# EAGLE design maze 1 (EAGLE 9.6.2)
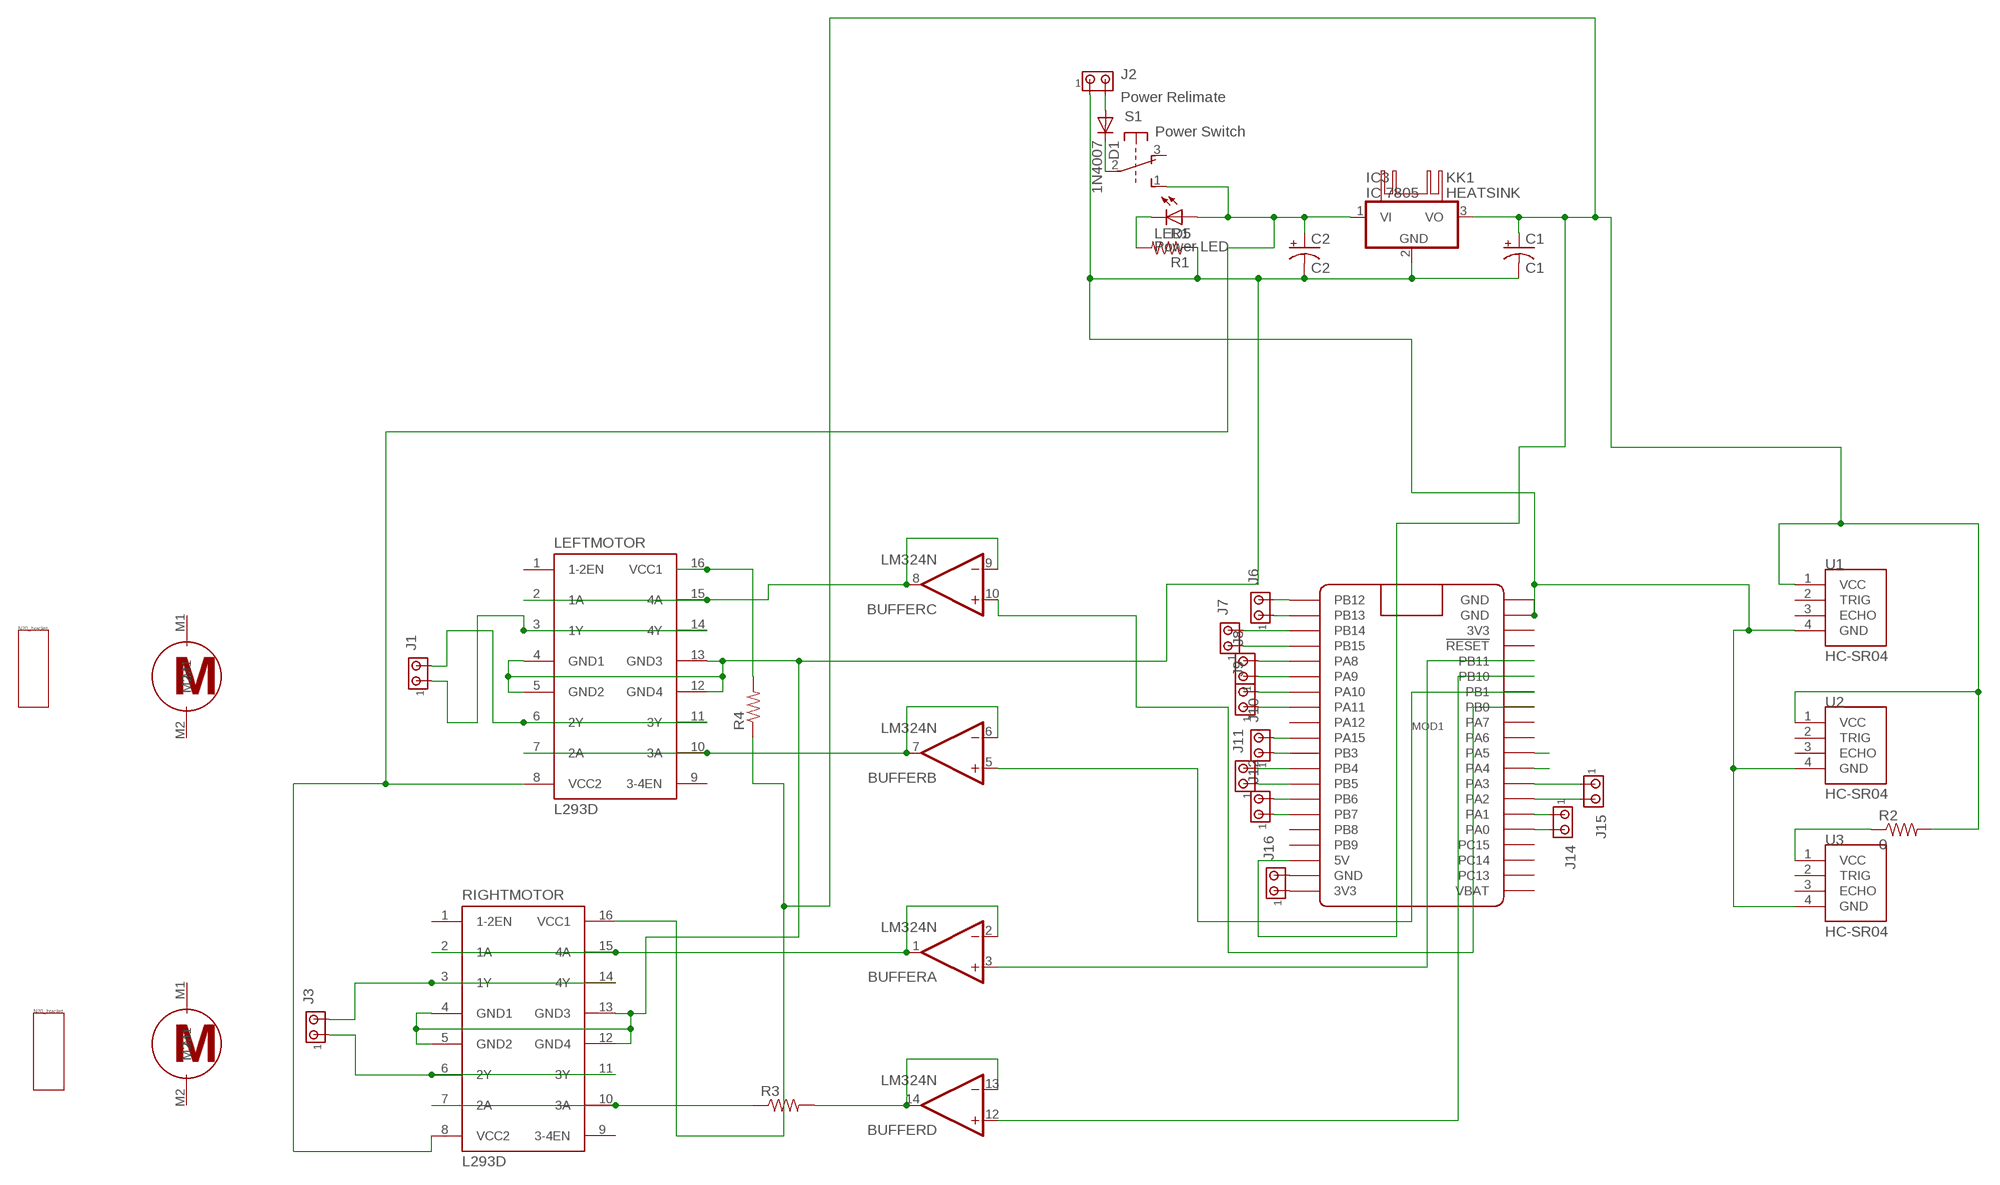
[diagram p0: schematic, sheet 1]

## Parts
BUFFER  LM324N  [DIL14]
C1  C1  1000UF-RADIAL-5MM-25V-20%  [CPOL-RADIAL-5MM-10MM]
C2  C2  CPOL-USE3.5-8  [E3,5-8]
D1  1N4007  1N4004  [DO41-10]
IC3  IC 7805  7805TV  [TO220V]
J1  MTA02-100  [10X02MTA]
J2  Power Relimate  MTA02-100  [10X02MTA]
J3  MTA02-100  [10X02MTA]
J6  MTA02-100  [10X02MTA]
J7  MTA02-100  [10X02MTA]
J8  MTA02-100  [10X02MTA]
J9  MTA02-100  [10X02MTA]
J10  MTA02-100  [10X02MTA]
J11  MTA02-100  [10X02MTA]
J12  MTA02-100  [10X02MTA]
J14  MTA02-100  [10X02MTA]
J15  MTA02-100  [10X02MTA]
J16  MTA02-100  [10X02MTA]
KK1  HEATSINK  [HEATSINK]
LED5  Power LED  LED3MM  [LED3MM]
LEFTMOTOR  L293D  [DIL16]
MOD1  BLUE_PILL  [BLUE_PILL]
R1  R1  R-US_0204/7  [0204/7]
R2  0  R-US_0204/7  [0204/7]
R3  R-US_0204/7  [0204/7]
R4  R-US_0204/7  [0204/7]
RIGHTMOTOR  L293D  [DIL16]
S1  Power Switch  9077-2  [9077-2]
U1  HC-SR04  [XCVR_HC-SR04]
U2  HC-SR04  [XCVR_HC-SR04]
U3  HC-SR04  [XCVR_HC-SR04]
U$1  MOTOR_N20  [MOTOR_N20]
U$2  MOTOR_N20  [MOTOR_N20]
U$4  N20_BRACKET  [BRACKER]
U$5  N20_BRACKET  [BRACKER]

## Nets
5V: C1.+ IC3.3(VO) MOD1.P$18(5V) R2.2 R4.1 RIGHTMOTOR.16(VCC1) U1.1(VCC) U2.1(VCC)
12V: C2.+ IC3.1(VI) LED5.A LEFTMOTOR.8(VCC2) RIGHTMOTOR.8(VCC2) S1.1(1:S)
GND: C1.- C2.- IC3.2(GND) J2.1 LEFTMOTOR.4(GND1) LEFTMOTOR.5(GND2) LEFTMOTOR.12(GND4) LEFTMOTOR.13(GND3) MOD1.P$21(GND) MOD1.P$22(GND) R1.1 RIGHTMOTOR.4(GND1) RIGHTMOTOR.5(GND2) RIGHTMOTOR.12(GND4) RIGHTMOTOR.13(GND3) U1.4(GND) U2.4(GND) U3.4(GND)
N$1: BUFFER.12(D:+IN) MOD1.P$26(PB10)
N$2: D1.A J2.2
N$3: BUFFER.5(B:+IN) MOD1.P$27(PB1)
N$4: R2.1 U3.1(VCC)
N$5: J1.2 LEFTMOTOR.6(2Y) LEFTMOTOR.11(3Y)
N$6: LED5.K(C) R1.2
N$7: BUFFER.8(C:OUT) BUFFER.9(C:-IN) LEFTMOTOR.2(1A) LEFTMOTOR.15(4A)
N$9: BUFFER.13(D:-IN) BUFFER.14(D:OUT) R3.2
N$10: BUFFER.10(C:+IN) MOD1.P$28(PB0)
N$11: D1.C S1.2(1:P)
N$13: LEFTMOTOR.16(VCC1) R4.2
N$15: BUFFER.6(B:-IN) BUFFER.7(B:OUT) LEFTMOTOR.7(2A) LEFTMOTOR.10(3A)
N$18: J1.1 LEFTMOTOR.3(1Y) LEFTMOTOR.14(4Y)
N$20: MOD1.P$31(PA5)
N$22: MOD1.P$32(PA4)
N$24: BUFFER.3(A:+IN) MOD1.P$25(PB11)
N$25: R3.1 RIGHTMOTOR.7(2A) RIGHTMOTOR.10(3A)
N$26: J15.1 MOD1.P$33(PA3)
N$27: J15.2 MOD1.P$34(PA2)
N$28: J14.1 MOD1.P$35(PA1)
N$29: J14.2 MOD1.P$36(PA0)
N$30: J6.1 MOD1.P$2(PB13)
N$31: J6.2 MOD1.P$1(PB12)
N$32: J3.2 RIGHTMOTOR.3(1Y) RIGHTMOTOR.14(4Y)
N$33: J7.2 MOD1.P$3(PB14)
N$34: BUFFER.1(A:OUT) BUFFER.2(A:-IN) RIGHTMOTOR.2(1A) RIGHTMOTOR.15(4A)
N$35: J3.1 RIGHTMOTOR.6(2Y) RIGHTMOTOR.11(3Y)
N$36: J7.1 MOD1.P$4(PB15)
N$37: J8.2 MOD1.P$5(PA8)
N$38: J8.1 MOD1.P$6(PA9)
N$39: J10.2 MOD1.P$10(PA15)
N$40: J10.1 MOD1.P$11(PB3)
N$41: J11.2 MOD1.P$12(PB4)
N$42: J11.1 MOD1.P$13(PB5)
N$43: J12.2 MOD1.P$14(PB6)
N$44: J12.1 MOD1.P$15(PB7)
N$47: J9.2 MOD1.P$7(PA10)
N$48: J9.1 MOD1.P$8(PA11)
N$49: J16.1 MOD1.P$20(3V3)
N$50: J16.2 MOD1.P$19(GND)
Unconnected: LEFTMOTOR.1(1-2EN) LEFTMOTOR.9(3-4EN) MOD1.P$9(PA12) MOD1.P$16(PB8) MOD1.P$17(PB9) MOD1.P$23(3V3) MOD1.P$24(!RESET) MOD1.P$29(PA7) MOD1.P$30(PA6) MOD1.P$37(PC15) MOD1.P$38(PC14) MOD1.P$39(PC13) MOD1.P$40(VBAT) RIGHTMOTOR.1(1-2EN) RIGHTMOTOR.9(3-4EN) S1.3(1:O) S1.4(2:S) S1.5(2:P) S1.6(2:O) U1.2(TRIG) U1.3(ECHO) U2.2(TRIG) U2.3(ECHO) U3.2(TRIG) U3.3(ECHO) U$1.M1 U$1.M2 U$2.M1 U$2.M2

## Power pins joined to a net without a drawn wire
5V: BUFFER.4(P:V+)
GND: BUFFER.11(P:V-)

## Library data of the parts
BUFFER = linear:LM324: OP AMP
C1 = SparkFun-Capacitors:1000UF: 1,000µF/1mF ceramic capacitors A capacitor is a passive two-terminal electrical component used to store electrical energy temporarily in an electric field. CAP-08070; PROD_ID: CAP-09538; VALUE: 1mF
C2 = adafruit:CPOL-US: POLARIZED CAPACITOR, American symbol
D1 = adafruit:1N4004: DIODE General purpose 1N400x type rectifier (With bigger pads) http://www.ladyada.net/library/pcb/eaglelibrary.html
IC3 = linear:78*: Positive VOLTAGE REGULATOR Source: http://cache.national.com/ds/LM/LM78L05.pdf http://www.fairchildsemi.com/ds/LM/LM7805.pdf
J1-J3 J6-J12 J14-J16 = con-amp:MTA02-100: AMP connector
KK1 = heatsink:HEATSINK: Made by Aniruddha Damle (TRSKNCOE)
LED5 = adafruit:LED: LED OSRAM: - CHIPLED LG R971, LG N971, LY N971, LG Q971, LY Q971, LO R971, LY R971 LH N974, LH R974 LS Q976, LO Q976, LY Q976 LO Q996 - Hyper CHIPLED LW Q18S LB Q993, LB Q99A, LB R99A - SideLED LS A670, LO A670, LY A670, LG A670, LP A670 LB A673, LV A673, LT A673, LW A673 LH A674 LY A675 LS A676, LA A676, LO A676, LY A676, LW A676 LS A679, LY A679, LG A679 - Hyper Micro SIDELED® LS Y876, LA Y876, LO Y876, LY Y876 LT Y87S - SmartLED LW L88C, LW L88S LB L89C, LB L89S, LG L890 LS L89K, LO L89K, LY L89K LS L896, LA L896, LO L896, LY L896 - TOPLED LS T670, LO T670, LY T670, LG T670, LP T670 LSG T670, LSP T670, LSY T670, LOP T670, LYG T670 LG T671, LOG T671, LSG T671 LB T673, LV T673, LT T673, LW T673 LH T674 LS T676, LA T676, LO T676, LY T676, LB T676, LH T676, LSB T676, LW T676 LB T67C, LV T67C, LT T67C, LS T67K, LO T67K, LY T67K, LW E67C LS E67B, LA E67B, LO E67B, LY E67B, LB E67C, LV E67C, LT E67C LW T67C LS T679, LY T679, LG T679 LS T770, LO T770, LY T770, LG T770, LP T770 LB T773, LV T773, LT T773, LW T773 LH T774 LS E675, LA E675, LY E675, LS T675 LS T776, LA T776, LO T776, LY T776, LB T776 LHGB T686 LT T68C, LB T68C - Hyper Mini TOPLED® LB M676 - Mini TOPLED Santana® LG M470 LS M47K, LO M47K, LY M47K Source: http://www.osram.convergy.de/
LEFTMOTOR RIGHTMOTOR = st-microelectronics:L293D: PUSH-PULL 4 CHANNEL DRIVER; MPN: L293D; OC_FARNELL: 9589619; OC_NEWARK: 56P8249
MOD1 = BluePill:BLUE_PILL
R1-R4 = adafruit:R-US_: RESISTOR, American symbol
S1 = switch-misc:9077-2: MARQUARDT SWITCH 9077.0200 Distributor: Buerklin <https://www.buerklin.com/default.asp?event=ShowArtikel%2812G2822%29&l=d&jump=ArtNr_12G2822>
U1-U3 = HC-SR04:HC-SR04: Ultrasonic Sensor Module Check availability <https://pricing.snapeda.com/parts/HC-SR04/OSEPP%20Electronics/view-part?ref=eda>; AVAILABILITY: In Stock; CHECK_PRICES: https://www.snapeda.com/parts/HC-SR04/Applied+Avionics/view-part/?ref=eda; DESCRIPTION: Ultrasonic Sensor Module,Rectangular,20-4000 mm,5 V,15 mA,Arduino Compatible | OSEPP HC-SR04; MF: OSEPP Electronics; MP: HC-SR04; PACKAGE: None; PRICE: None; SNAPEDA_LINK: https://www.snapeda.com/parts/HC-SR04/Applied+Avionics/view-part/?ref=snap
U$1 U$2 = Motor N20:MOTOR_N20
U$4 U$5 = Motor N20:N20_BRACKET

## Board
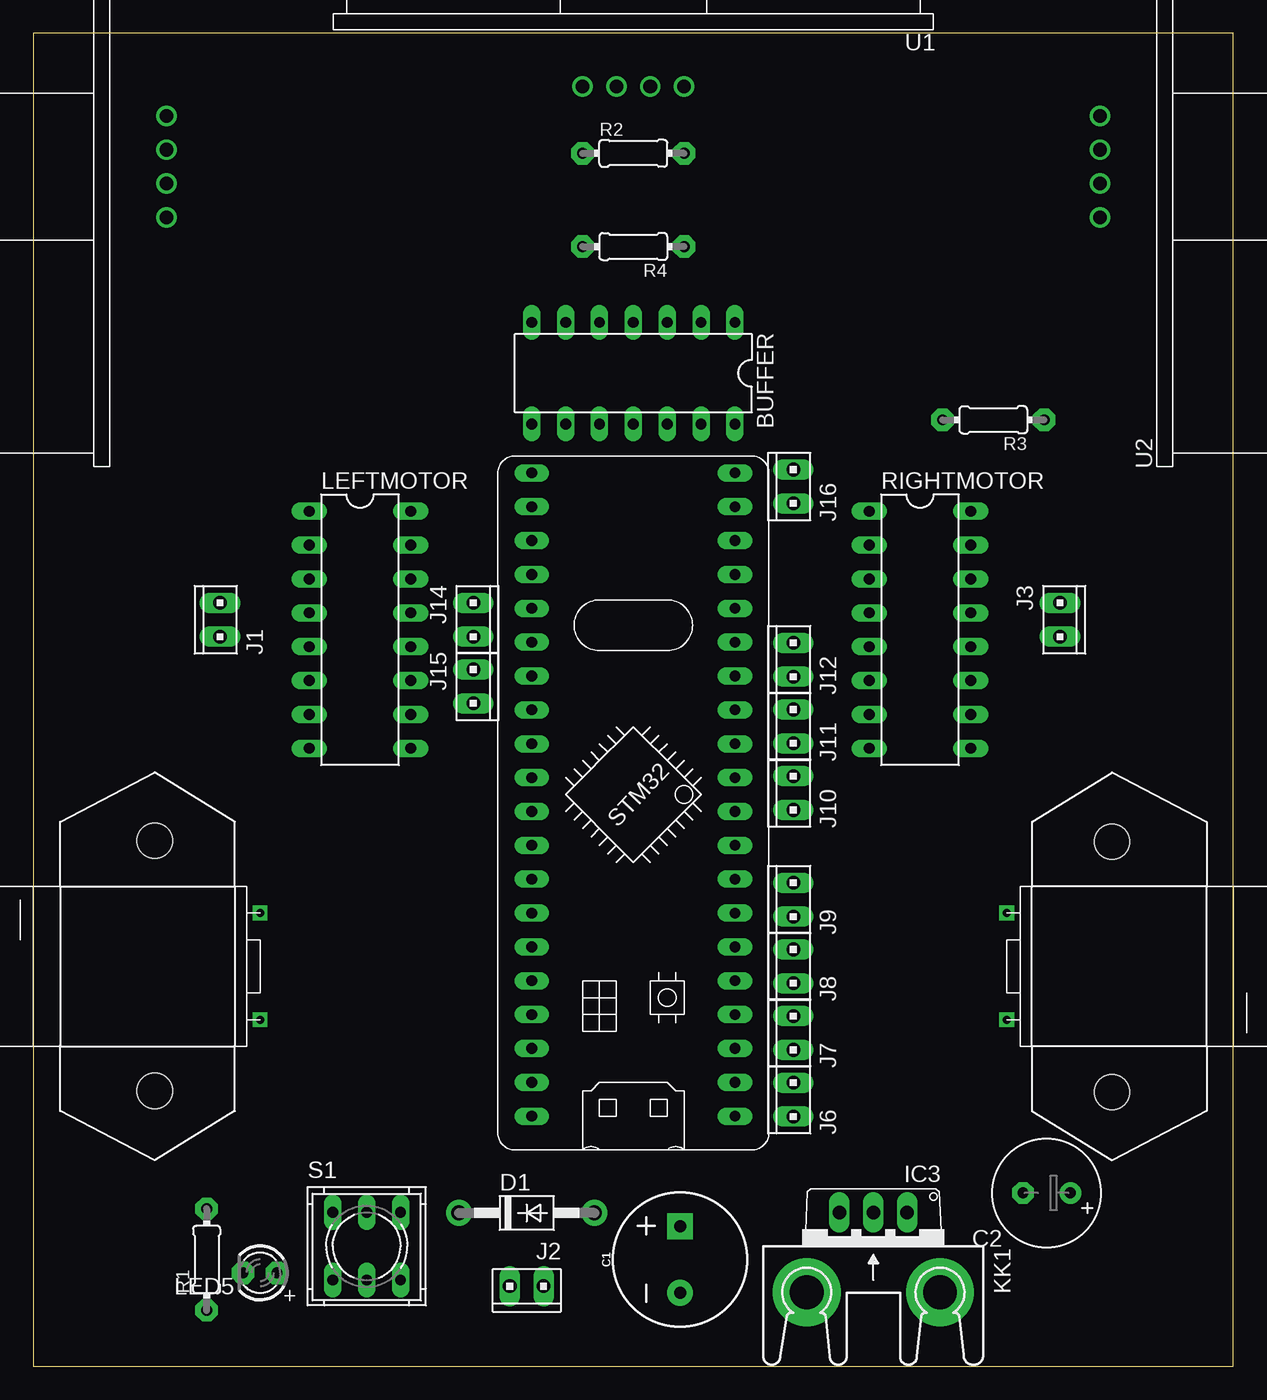
[diagram p1: board, top side]
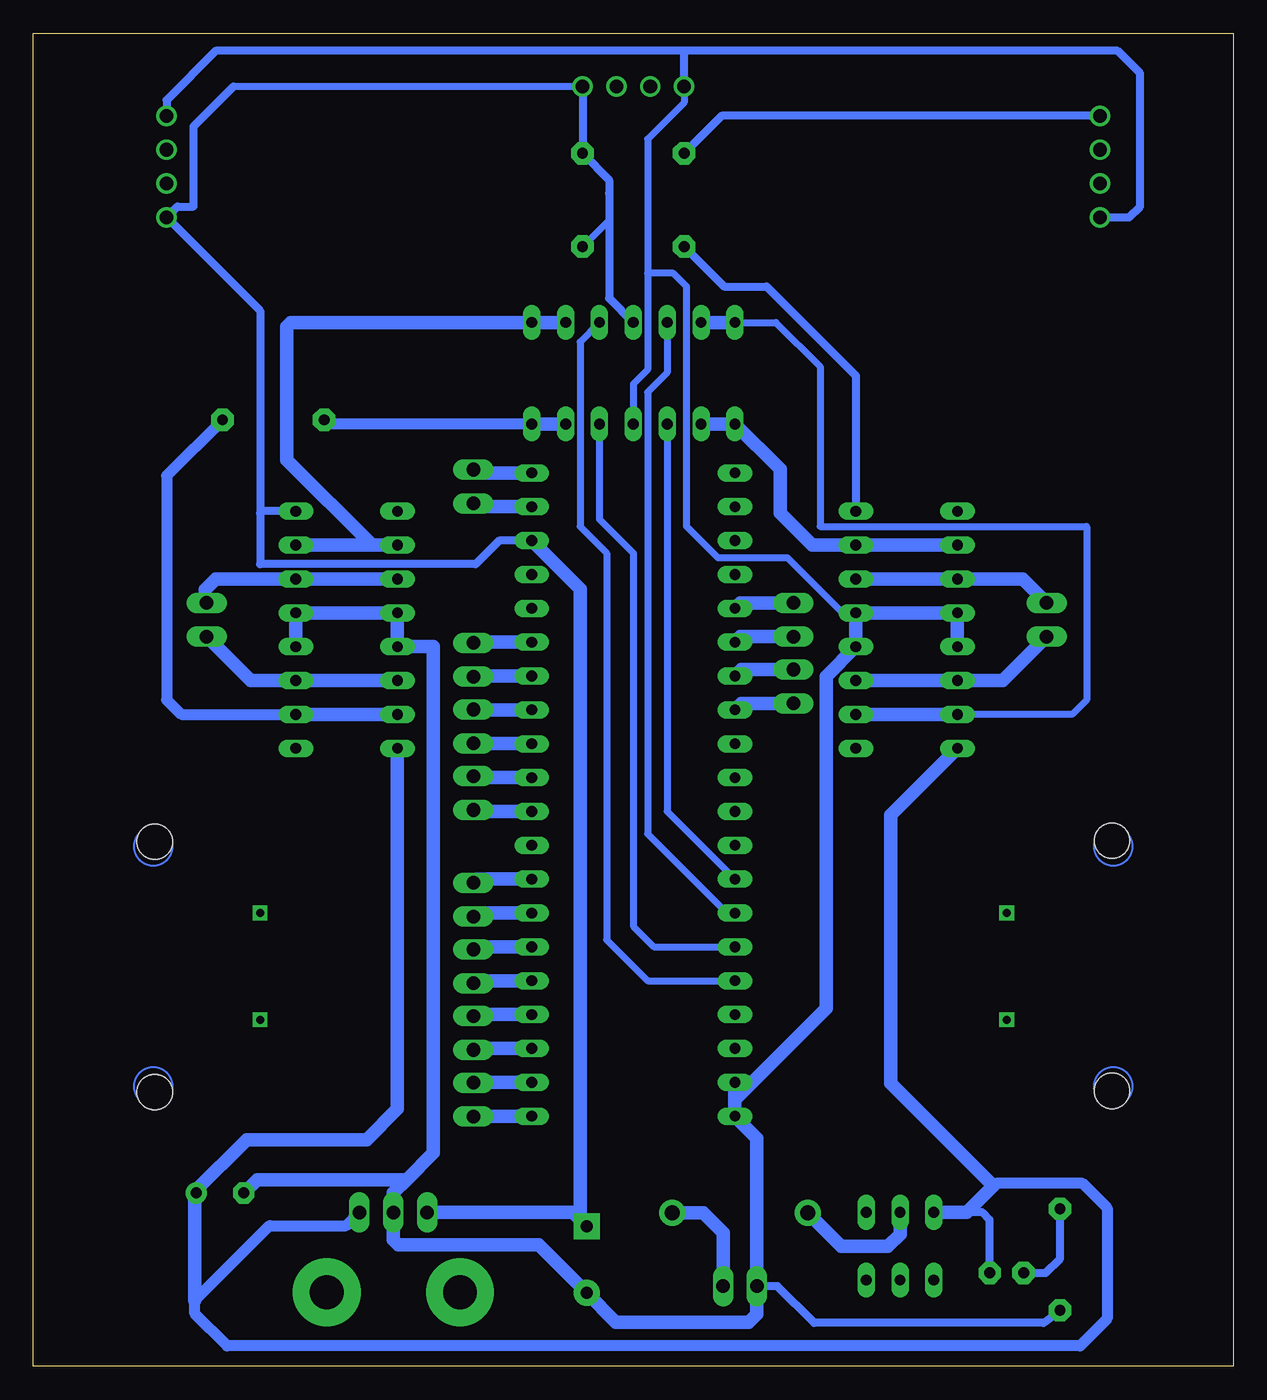
[diagram p2: board, bottom side, seen from below]

Size 90 x 100 mm. Coordinates in mm from the lower left corner, seen from the top.
Outline: 0,0 90,0 90,100 0,100 0,0
Copper layers (1*16): Top 0.035mm / dielectric 1.5mm / Bottom 0.035mm
Design rules "default *": minimum track width 10mil, minimum drill 24mil, track to track 8mil, track to pad 6mil, pad to pad 8mil, via to via 8mil, smd to smd 8mil, copper to edge 40mil, drill to drill 8mil, minimum pad ring 10mil, minimum via ring 8mil, stop-mask expansion 4mil, vias tented up to drill 0mil, thermal gap 10mil

### Footprints (pad centres in the part's own frame; a part is rotated, then mirrored left to right if it is on the bottom)
DIL14 = drill 0.813 long: 1 -7.62,-3.81; 2 -5.08,-3.81; 3 -2.54,-3.81; 4 0,-3.81; 5 2.54,-3.81; 6 5.08,-3.81; 7 7.62,-3.81; 8 7.62,3.81; 9 5.08,3.81; 10 2.54,3.81; 11 0,3.81; 12 -2.54,3.81; 13 -5.08,3.81; 14 -7.62,3.81
CPOL-RADIAL-5MM-10MM = drill 0.9 pad 1.93 square: + 2.5,0 | drill 0.9 pad 1.93: - -2.5,0
E3,5-8 = drill 0.813 pad 1.6: + -1.778,0 | drill 0.813 pad 1.6 octagon: - 1.778,0
DO41-10 = drill 1.118 pad 1.93: A 5.08,0; C -5.08,0
TO220V = drill 1.016 long: 1 -2.54,-2.54; 2 0,-2.54; 3 2.54,-2.54
10X02MTA = drill 1.016 long: 1 1.27,0; 2 -1.27,0
HEATSINK = drill 2.54 pad 5.08: A2,5 -5,3.45; B2,5 5,3.45
LED3MM = drill 0.813 pad 1.676 octagon: A -1.27,0; K 1.27,0
DIL16 = drill 0.813 long: 1 -8.89,-3.81; 2 -6.35,-3.81; 3 -3.81,-3.81; 4 -1.27,-3.81; 5 1.27,-3.81; 6 3.81,-3.81; 7 6.35,-3.81; 8 8.89,-3.81; 9 8.89,3.81; 10 6.35,3.81; 11 3.81,3.81; 12 1.27,3.81; 13 -1.27,3.81; 14 -3.81,3.81; 15 -6.35,3.81; 16 -8.89,3.81
BLUE_PILL = drill 0.8 long: P$1 -7.62,15.24; P$2 -7.62,12.7; P$3 -7.62,10.16; P$4 -7.62,7.62; P$5 -7.62,5.08; P$6 -7.62,2.54; P$7 -7.62,0; P$8 -7.62,-2.54; P$9 -7.62,-5.08; P$10 -7.62,-7.62; P$11 -7.62,-10.16; P$12 -7.62,-12.7; P$13 -7.62,-15.24; P$14 -7.62,-17.78; P$15 -7.62,-20.32; P$16 -7.62,-22.86; P$17 -7.62,-25.4; P$18 -7.62,-27.94; P$19 -7.62,-30.48; P$20 -7.62,-33.02; P$21 7.62,15.24; P$22 7.62,12.7; P$23 7.62,10.16; P$24 7.62,7.62; P$25 7.62,5.08; P$26 7.62,2.54; P$27 7.62,0; P$28 7.62,-2.54; P$29 7.62,-5.08; P$30 7.62,-7.62; P$31 7.62,-10.16; P$32 7.62,-12.7; P$33 7.62,-15.24; P$34 7.62,-17.78; P$35 7.62,-20.32; P$36 7.62,-22.86; P$37 7.62,-25.4; P$38 7.62,-27.94; P$39 7.62,-30.48; P$40 7.62,-33.02
0204/7 = drill 0.813 pad 1.676 octagon: 1 -3.81,0; 2 3.81,0
9077-2 = drill 0.813 long: 1 -2.54,2.54; 2 0,2.54; 3 2.54,2.54; 4 -2.54,-2.54; 5 0,-2.54; 6 2.54,-2.54
XCVR_HC-SR04 = drill 1.02: 1 -3.81,0; 2 -1.27,0; 3 1.27,0; 4 3.81,0
MOTOR_N20 = drill 0.6 square: M1 2,-1; M2 10,-1
BRACKER = hole 2.66: -3.43,7.1; 15.35,7.1

### Placement (x,y rotation side)
BUFFER  45,74.5 180 top
C1  48.5,8 90 top
C2  76,13 180 top
D1  37,11.5 0 top
IC3  63,9 180 top
J1  14,56 90 top
J2  37,6 180 top
J3  77,56 270 top
J6  57,20 90 top
J7  57,25 90 top
J8  57,30 90 top
J9  57,35 90 top
J10  57,43 90 top
J11  57,48 90 top
J12  57,53 90 top
J14  33,56 270 top
J15  33,51 270 top
J16  57,66 90 top
KK1  63,9 180 top
LED5  17,7 180 top
LEFTMOTOR  24.5,55.25 270 top
MOD1  45,34 180 top
R1  13,8 90 top
R2  45,91 0 top
R3  72,71 180 top
R4  45,84 180 top
RIGHTMOTOR  66.5,55.25 270 top
S1  25,9 0 top
U1  45,96 180 top
U2  80,90 90 top
U3  10,90 270 top
U$1  74,36 270 top
U$2  16,24 90 top
U$4  2,36 270 top
U$5  88,24 90 top

### Tracks (layer width: path | path; a pad name or v marks a point on that pad's centre or on a via)
5V
  Bottom 0.508: U1.1 75,96 | 80.19,86.19 U2.1 | 46.81,88 46.81,86 R4.1
  Bottom 0.61: MOD1.P$18 55.06,61.94 56.82,60.18 73,60.18 73,64 | 73,64 73,79.19 U2.1 79.19,87 78,87 78,93 75,96 | U1.1 R2.2 46.81,89 46.81,88 46.81,80.12 BUFFER.4 | RIGHTMOTOR.16 72.86,64.14 73,64
  Bottom 1.016: C1.+ 49,11 | 49,11 49.54,11.54 IC3.3 | MOD1.P$18 49,58.32 49,11
12V
  Bottom 0.61: LED5.A 18.27,11 18.81,11.54 20,11.54
  Bottom 0.813: IC3.1 66.54,10.54 72.26,10.54 72.26,10.56 77.89,4.93 77.89,3.94 75.47,1.52 11.5,1.52 9.46,3.56 9.46,11.88 11.3,13.72 17.82,13.72 18.01,13.53
  Bottom 1.016: 77.89,4.93 77.89,12.89 C2.+ 77.89,13.11 74,17 65,17 62.69,19.31 RIGHTMOTOR.8 | LEFTMOTOR.8 25.69,41.36 25.69,21.21 18.01,13.53 20,11.54 S1.1
GND
  Bottom 0.508: BUFFER.11 45,73.69 43.93,74.76 43.93,82 | 43.93,82 43.93,92.07 41.19,94.81 U1.4 | LEFTMOTOR.13 29.31,56.52 33.42,60.63 38.63,60.63 41,63 41,81 42,82 43.93,82
  Bottom 0.61: R1.1 14.22,3.25 31.44,3.25 34.19,6 J2.1 | U3.4 7.81,86.19 7,87 7,97 8.68,98.68 41,98.68 | U2.4 80,95 76.32,98.68 41,98.68 | U1.4 41.19,98.49 41,98.68
  Bottom 1.016: LEFTMOTOR.5 LEFTMOTOR.4 LEFTMOTOR.13 LEFTMOTOR.12 30.53,51.76 30.53,26.85 37.38,20 | RIGHTMOTOR.12 RIGHTMOTOR.13 RIGHTMOTOR.4 RIGHTMOTOR.5 60,53.98 60,16 62,14 | 37.38,20 MOD1.P$21 35.73,17.11 J2.1 35.73,3.91 36.33,3.31 46.31,3.31 C1.- 52.1,9.1 62.62,9.1 63,9.48 IC3.2 63,13 62,14 | 37.38,20 MOD1.P$22 | C2.- 73.22,14 62,14
N$1
  Bottom 0.508: BUFFER.12 47.54,63.54 45,61 45,33 43.46,31.46 MOD1.P$26
N$2
  Bottom 1.016: J2.2 38.27,10.02 39.75,11.5 D1.A
N$3
  Bottom 0.508: BUFFER.5 42.46,74.54 43.93,73.07 43.93,39.93 38,34 MOD1.P$27
N$4
  Bottom 0.61: U3.1 38.38,93.81 R2.1
N$5
  Bottom 1.016: LEFTMOTOR.11 LEFTMOTOR.6 17.29,51.44 J1.2
N$6
  Bottom 0.61: R1.2 13,8.07 14.07,7 LED5.K
N$7
  Bottom 1.016: LEFTMOTOR.2 LEFTMOTOR.15 31.6,61.6 34,64 34,67.31 BUFFER.8 BUFFER.9
N$9
  Bottom 0.813: BUFFER.14 67.88,70.69 R3.2
  Bottom 1.016: BUFFER.14 BUFFER.13
N$10
  Bottom 0.508: BUFFER.10 42.46,41.62 MOD1.P$28
N$11
  Bottom 1.016: S1.2 25,9.91 25.91,9 29.42,9 D1.C
N$13
  Bottom 0.61: R4.2 38.19,81 35,81 28.31,74.31 LEFTMOTOR.16
N$15
  Bottom 0.508: BUFFER.7 34.31,78.31 31,75 31,63 11,63 11,50 12.1,48.9 LEFTMOTOR.7
  Bottom 1.016: LEFTMOTOR.7 LEFTMOTOR.10 | BUFFER.7 BUFFER.6
N$18
  Bottom 1.016: LEFTMOTOR.14 LEFTMOTOR.3 15.79,59.06 J1.1
N$24
  Bottom 0.508: BUFFER.3 49,76.85 49,63 47,61 47,32 43.92,28.92 MOD1.P$25
N$25
  Bottom 0.813: R3.1 80,66.81 80,50 78.9,48.9 RIGHTMOTOR.10
  Bottom 1.016: RIGHTMOTOR.7 RIGHTMOTOR.10
N$26
  Bottom 1.016: J15.1 36.89,49.73 MOD1.P$33
N$27
  Bottom 1.016: J15.2 36.89,52.27 MOD1.P$34
N$28
  Bottom 1.016: J14.1 36.97,54.73 MOD1.P$35
N$29
  Bottom 1.016: J14.2 36.97,57.27 MOD1.P$36
N$30
  Bottom 1.016: MOD1.P$2 56.97,21.3 J6.1
N$31
  Bottom 1.016: MOD1.P$1 56.97,18.76 J6.2
N$32
  Bottom 1.016: RIGHTMOTOR.3 RIGHTMOTOR.14 76.31,59.06 77.1,58.27 77.1,57.37 J3.2
N$33
  Bottom 1.016: MOD1.P$3 56.89,23.84 J7.2
N$34
  Bottom 1.016: RIGHTMOTOR.15 RIGHTMOTOR.2 64.6,61.6 71,68 71,78 70.69,78.31 BUFFER.1 BUFFER.2
N$35
  Bottom 1.016: RIGHTMOTOR.6 RIGHTMOTOR.11 73.71,51.44 J3.1
N$36
  Bottom 1.016: MOD1.P$4 56.89,26.38 J7.1
N$37
  Bottom 1.016: MOD1.P$5 56.81,28.92 J8.2
N$38
  Bottom 1.016: MOD1.P$6 56.81,31.46 J8.1
N$39
  Bottom 1.016: MOD1.P$10 56.89,41.62 J10.2
N$40
  Bottom 1.016: MOD1.P$11 56.89,44.16 J10.1
N$41
  Bottom 1.016: MOD1.P$12 52.65,46.73 J11.2
N$42
  Bottom 1.016: MOD1.P$13 56.97,49.24 J11.1
N$43
  Bottom 1.016: MOD1.P$14 56.95,51.78 J12.2
N$44
  Bottom 1.016: MOD1.P$15 56.95,54.32 J12.1
N$47
  Bottom 1.016: MOD1.P$7 56.73,34 J9.2
N$48
  Bottom 1.016: MOD1.P$8 56.73,36.54 J9.1
N$49
  Bottom 1.016: MOD1.P$20 56.75,67.02 J16.1
N$50
  Bottom 1.016: MOD1.P$19 56.75,64.48 J16.2
(copper drawn outside any net)
  shapes: Bottom circle x4